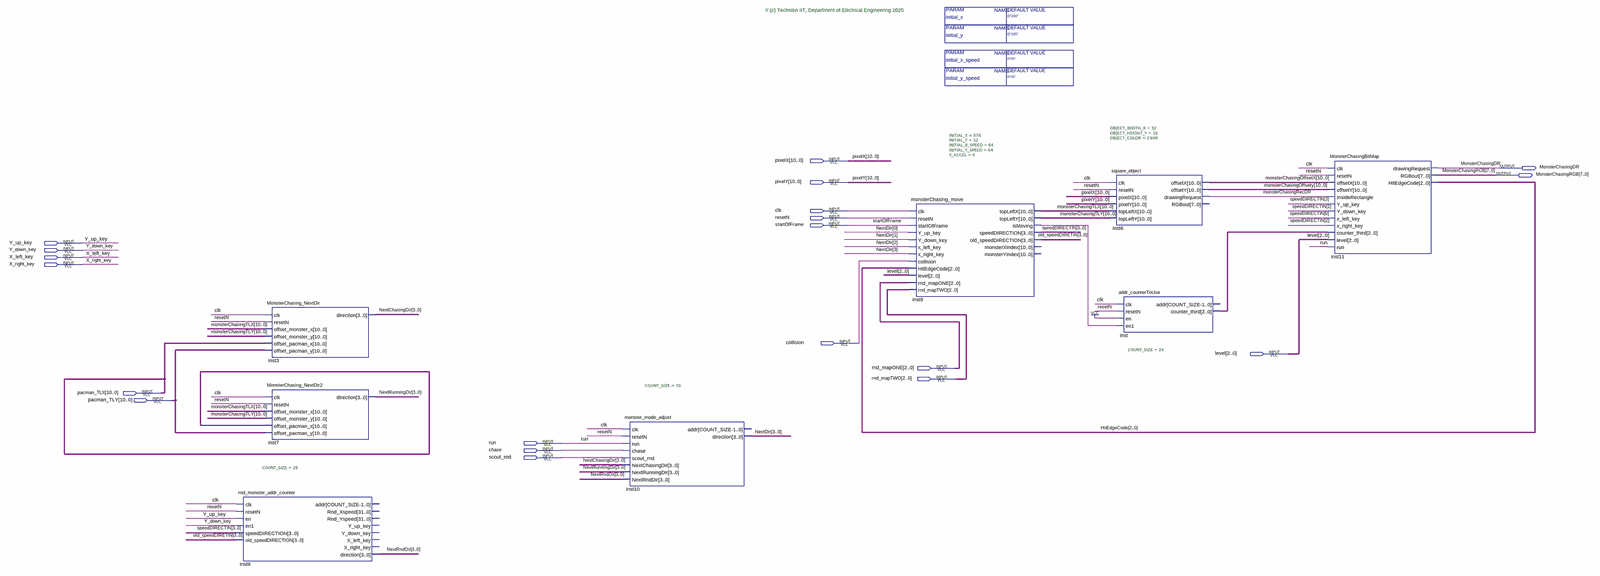
[diagram p0: schematic sheet, whole]
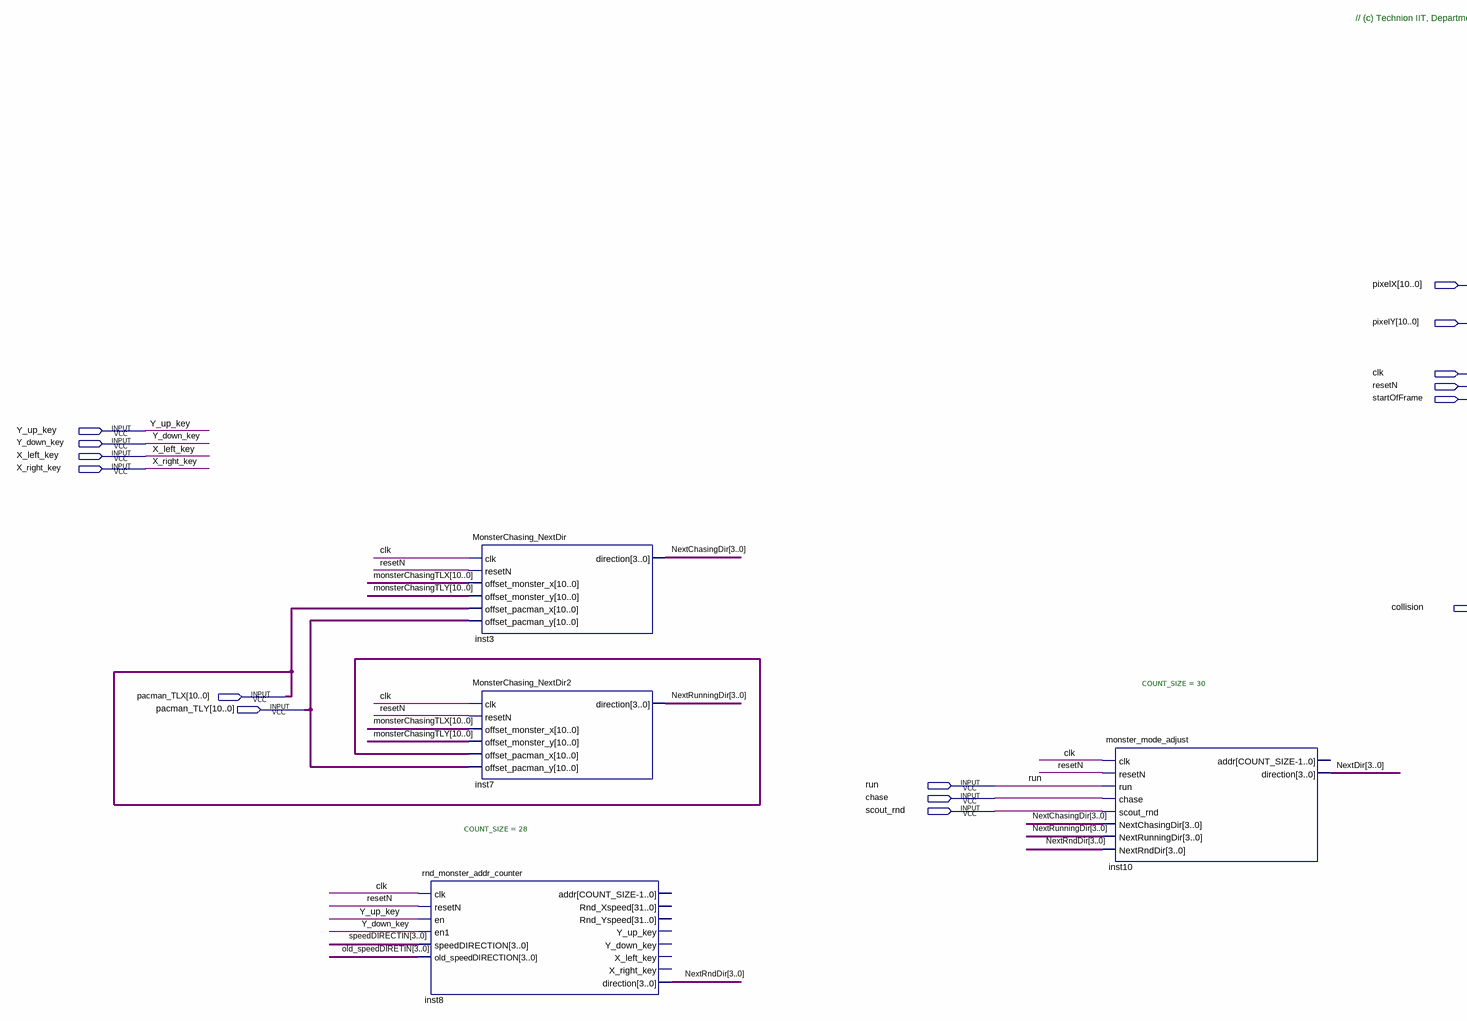
[diagram p1: schematic sheet, left part]
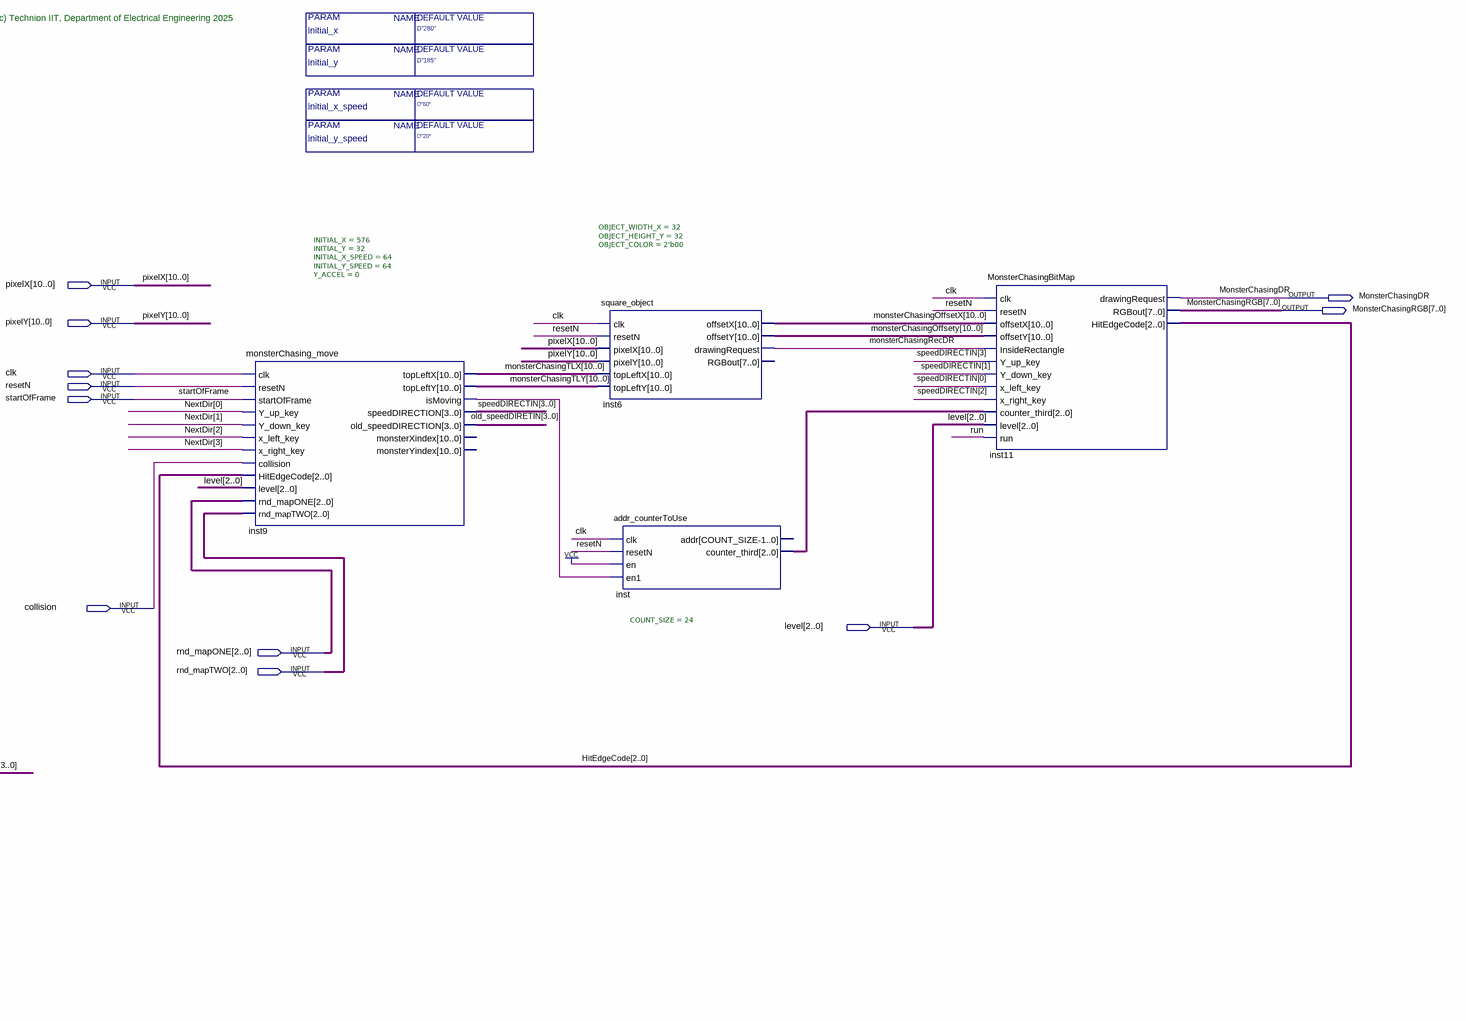
[diagram p2: schematic sheet, right part]
// Quartus schematic MonsterScoutANDChase_Block_T.bdf as structural Verilog: 8 symbols, 20 pins
module MonsterScoutANDChase_Block_T #(parameter initial_x = "D\"280\"", parameter initial_y = "D\"185\"", parameter initial_x_speed = "D\"60\"", parameter initial_y_speed = "D\"20\"") (
  input  [10:0] pixelX,
  input  [10:0] pixelY,
  input  clk,
  input  resetN,
  input  startOfFrame,
  input  Y_up_key,
  input  Y_down_key,
  input  X_left_key,
  input  X_right_key,
  input  collision,
  input  [2:0] level,
  input  [2:0] rnd_mapONE,
  input  [2:0] rnd_mapTWO,
  input  [10:0] pacman_TLX,
  input  [10:0] pacman_TLY,
  input  run,
  input  chase,
  input  scout_rnd,
  output MonsterChasingDR,
  output [7:0] MonsterChasingRGB
);

  wire inst9_ismoving, monsterChasingRecDR;
  wire [2:0] HitEdgeCode, inst_counter_third;
  wire [3:0] NextChasingDir, NextDir, NextRndDir, NextRunningDir, old_speedDIRETIN, speedDIRECTIN;
  wire [10:0] monsterChasingOffsetX, monsterChasingOffsety, monsterChasingTLX, monsterChasingTLY;

  rnd_monster_addr_counter #(.COUNT_SIZE(28)) inst8 (
    .clk(clk), .resetN(resetN), .en(Y_up_key), .en1(Y_down_key), .speedDIRECTION(speedDIRECTIN),
    .old_speedDIRECTION(old_speedDIRETIN), .direction(NextRndDir));  // open: addr, Rnd_Xspeed, Rnd_Yspeed, Y_up_key, Y_down_key, X_left_key, X_right_key
  MonsterChasing_NextDir inst3 (
    .clk(clk), .resetN(resetN), .offset_monster_x(monsterChasingTLX), .offset_monster_y(monsterChasingTLY),
    .offset_pacman_x(pacman_TLX), .offset_pacman_y(pacman_TLY), .direction(NextChasingDir));
  MonsterChasing_NextDir2 inst7 (
    .clk(clk), .resetN(resetN), .offset_monster_x(monsterChasingTLX), .offset_monster_y(monsterChasingTLY),
    .offset_pacman_x(pacman_TLX), .offset_pacman_y(pacman_TLY), .direction(NextRunningDir));
  monster_mode_adjust #(.COUNT_SIZE(30)) inst10 (
    .clk(clk), .resetN(resetN), .run(run), .chase(chase), .scout_rnd(scout_rnd),
    .NextChasingDir(NextChasingDir), .NextRunningDir(NextRunningDir), .NextRndDir(NextRndDir),
    .direction(NextDir));  // open: addr
  monsterChasing_move #(.INITIAL_X(576), .INITIAL_Y(32), .INITIAL_X_SPEED(64), .INITIAL_Y_SPEED(64), .Y_ACCEL(0)) inst9 (
    .clk(clk), .resetN(resetN), .startOfFrame(startOfFrame), .Y_up_key(NextDir[0]), .Y_down_key(NextDir[1]),
    .x_left_key(NextDir[2]), .x_right_key(NextDir[3]), .collision(collision), .HitEdgeCode(HitEdgeCode),
    .level(level), .rnd_mapONE(rnd_mapONE), .rnd_mapTWO(rnd_mapTWO), .topLeftX(monsterChasingTLX),
    .topLeftY(monsterChasingTLY), .isMoving(inst9_ismoving), .speedDIRECTION(speedDIRECTIN),
    .old_speedDIRECTION(old_speedDIRETIN));  // open: monsterXindex, monsterYindex
  square_object #(.OBJECT_WIDTH_X(32), .OBJECT_HEIGHT_Y(32), .OBJECT_COLOR(2'b00)) inst6 (
    .clk(clk), .resetN(resetN), .pixelX(pixelX), .pixelY(pixelY), .topLeftX(monsterChasingTLX),
    .topLeftY(monsterChasingTLY), .offsetX(monsterChasingOffsetX), .offsetY(monsterChasingOffsety),
    .drawingRequest(monsterChasingRecDR));  // open: RGBout
  addr_counterToUse #(.COUNT_SIZE(24)) inst (
    .clk(clk), .resetN(resetN), .en(1'b1), .en1(inst9_ismoving), .counter_third(inst_counter_third));  // open: addr
  MonsterChasingBitMap inst11 (
    .clk(clk), .resetN(resetN), .offsetX(monsterChasingOffsetX), .offsetY(monsterChasingOffsety),
    .InsideRectangle(monsterChasingRecDR), .Y_up_key(speedDIRECTIN[3]), .Y_down_key(speedDIRECTIN[1]),
    .x_left_key(speedDIRECTIN[0]), .x_right_key(speedDIRECTIN[2]), .counter_third(inst_counter_third),
    .level(level), .run(run), .drawingRequest(MonsterChasingDR), .RGBout(MonsterChasingRGB),
    .HitEdgeCode(HitEdgeCode));

  // Notes on the sheet:
  //   // (c) Technion IIT, Department of Electrical Engineering 2025
endmodule
